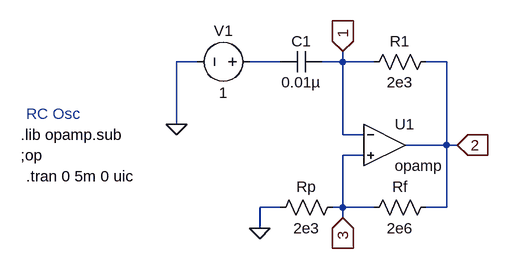
[diagram p0: schematic RC 0sc.asc]
RC 0sc.asc, the LTspice schematic file:
Version 4
SHEET 1 880 680
WIRE 80 -32 48 -32
WIRE 208 -32 160 -32
WIRE 304 -32 304 -48
WIRE 304 -32 272 -32
WIRE 352 -32 304 -32
WIRE 464 -32 432 -32
WIRE 48 64 48 -32
WIRE 304 80 304 -32
WIRE 336 80 304 80
WIRE 464 96 464 -32
WIRE 464 96 400 96
WIRE 480 96 464 96
WIRE 336 112 304 112
WIRE 208 192 176 192
WIRE 304 192 304 112
WIRE 304 192 288 192
WIRE 352 192 304 192
WIRE 464 192 464 96
WIRE 464 192 432 192
WIRE 304 208 304 192
WIRE 176 224 176 192
FLAG 176 224 0
FLAG 48 64 0
FLAG 304 -48 1
IOPIN 304 -48 In
FLAG 480 96 2
IOPIN 480 96 In
FLAG 304 208 3
IOPIN 304 208 In
SYMBOL OpAmps\\opamp 368 32 R0
SYMATTR InstName U1
SYMBOL res 448 -48 R90
WINDOW 0 0 56 VBottom 2
WINDOW 3 32 56 VTop 2
SYMATTR InstName R1
SYMATTR Value 2e3
SYMBOL res 192 208 R270
WINDOW 0 32 56 VTop 2
WINDOW 3 0 56 VBottom 2
SYMATTR InstName Rp
SYMATTR Value 2e3
SYMBOL res 336 208 R270
WINDOW 0 32 56 VTop 2
WINDOW 3 0 56 VBottom 2
SYMATTR InstName Rf
SYMATTR Value 2e6
SYMBOL cap 272 -48 R90
WINDOW 0 0 32 VBottom 2
WINDOW 3 32 32 VTop 2
SYMATTR InstName C1
SYMATTR Value 0.01µ
SYMBOL voltage 176 -32 R90
WINDOW 0 -32 56 VBottom 2
WINDOW 3 32 56 VTop 2
WINDOW 123 0 0 Left 0
WINDOW 39 0 0 Left 0
SYMATTR InstName V1
SYMATTR Value 1
TEXT -192 80 Left 2 !.lib opamp.sub
TEXT -192 112 Left 2 !;op
TEXT -184 48 Left 2 ;RC Osc
TEXT -184 144 Left 2 !.tran 0 5m 0 uic

The netlist it stands for:
* RC 0sc.asc
XU1 1 3 2 opamp Aol=100K GBW=10Meg  ; pins invin noninvin out
R1 2 1 2e3
Rp 0 3 2e3
Rf 3 2 2e6
C1 1 N001 0.01µ
V1 N001 0 1
.lib opamp.sub
;op
* RC Osc
.tran 0 5m 0 uic
.backanno
.end